# EAGLE schematic LPS3P3 (EAGLE 7.7.0)
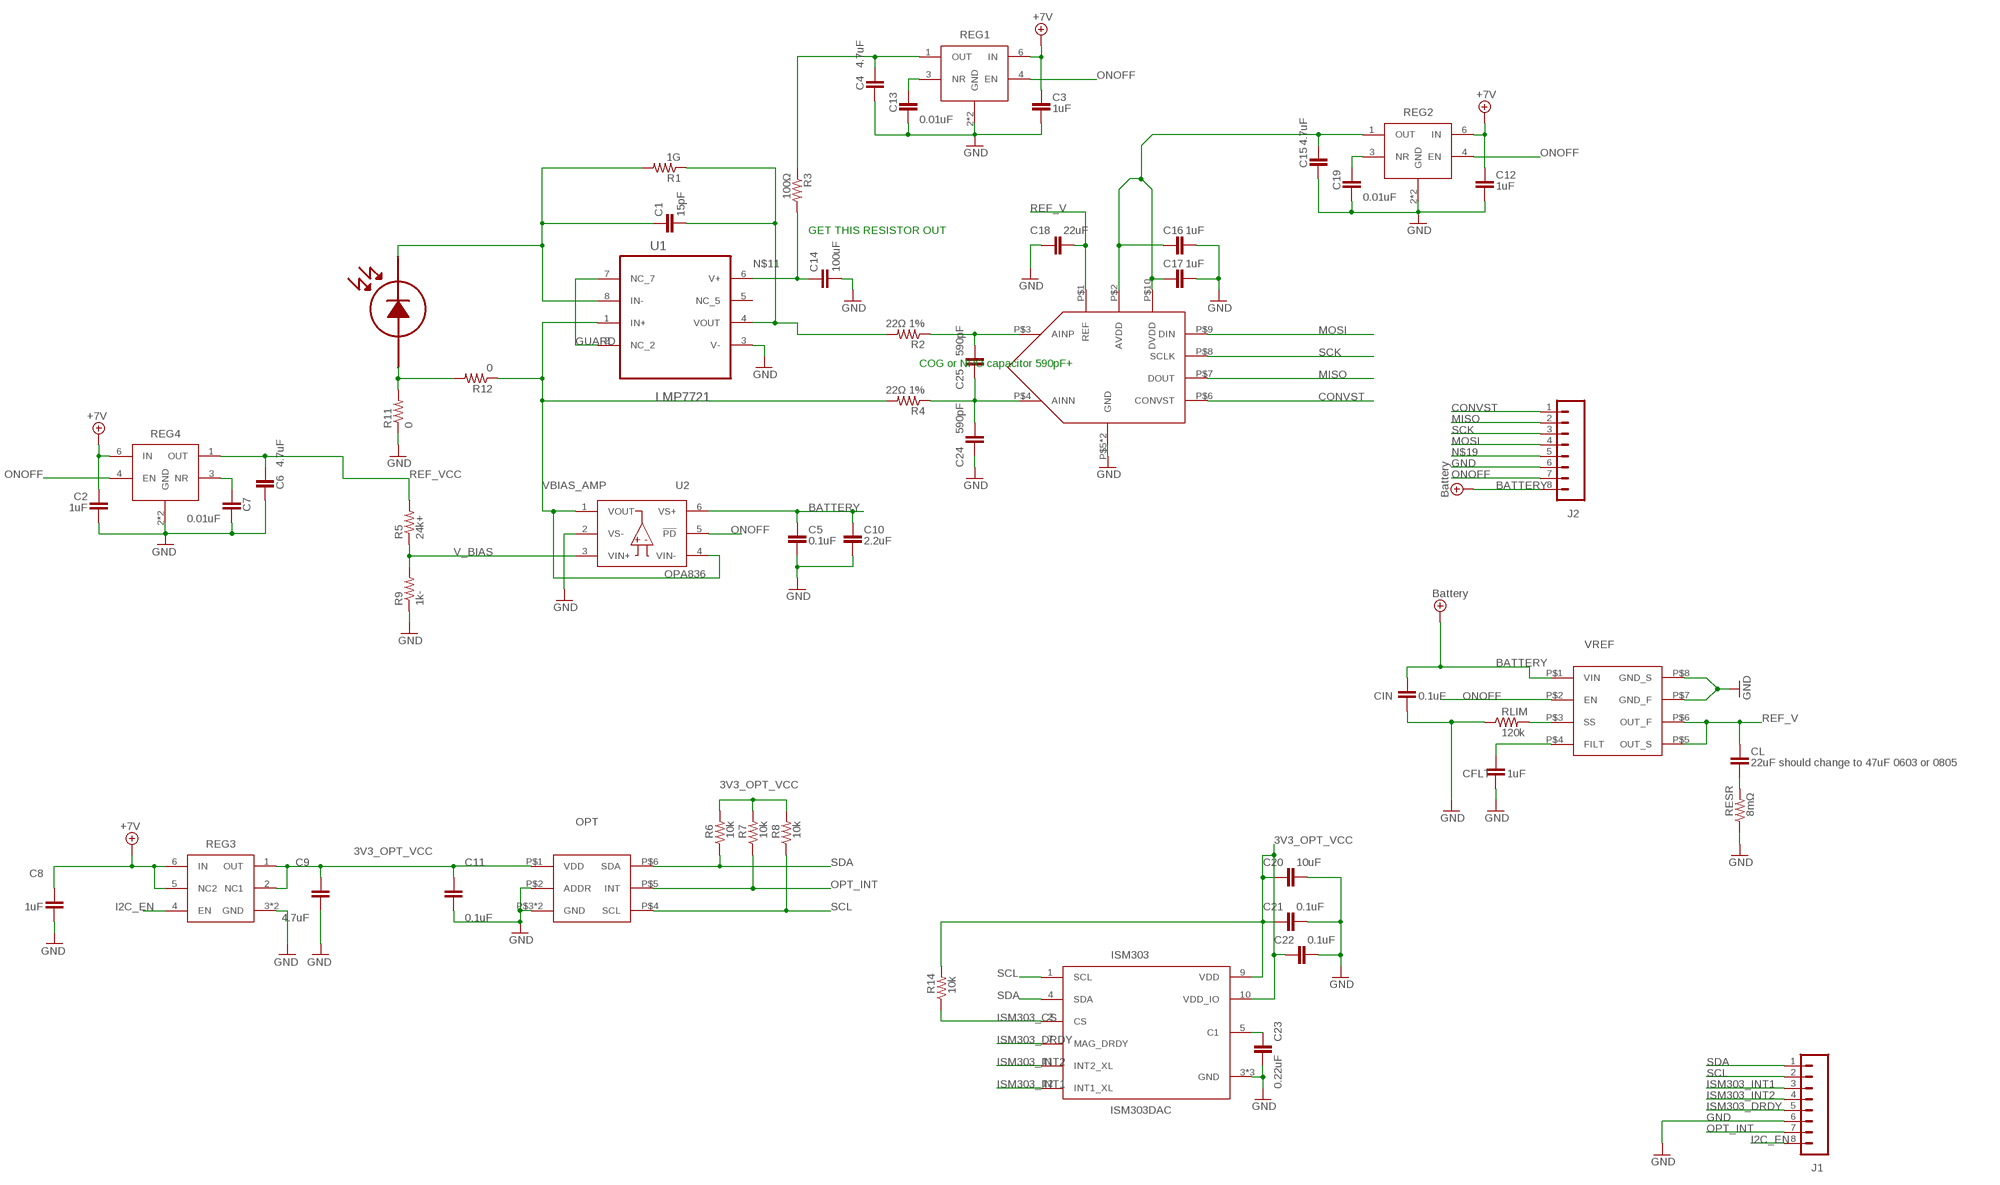
[diagram p0: schematic, sheet 1]

## Parts
ADC  ADS8866VSON10  [VSON-10]
C1  15pF  CAP_1206CAP-1206  [1206]
C2  1uF  CAP_0402  [SMD_0402]
C3  1uF  CAP_0402  [SMD_0402]
C4  4.7uF  CAP_0402  [SMD_0402]
C5  0.1uF  CAP_0402  [SMD_0402]
C6  4.7uF  CAP_0402  [SMD_0402]
C7  0.01uF  CAP_0402  [SMD_0402]
C8  1uF  CAP_0402  [SMD_0402]
C9  4.7uF  CAP_0402  [SMD_0402]
C10  2.2uF  CAP_0402  [SMD_0402]
C11  0.1uF  CAP_0402  [SMD_0402]
C12  1uF  CAP_0402  [SMD_0402]
C13  0.01uF  CAP_0402  [SMD_0402]
C14  100uF  2.2UF-25V-+80/-20(0805)  [0805-CAP]
C15  4.7uF  CAP_0402  [SMD_0402]
C16  1uF  CAP_0402  [SMD_0402]
C17  1uF  CAP_0402  [SMD_0402]
C18  22uF  CAP_0402  [SMD_0402]
C19  0.01uF  CAP_0402  [SMD_0402]
C20  10uF  CAP_0402  [SMD_0402]
C21  0.1uF  CAP_0402  [SMD_0402]
C22  0.1uF  CAP_0402  [SMD_0402]
C23  0.22uF  CAP_0402  [SMD_0402]
C24  590pF  CAP_0402  [SMD_0402]
C25  590pF  CAP_0402  [SMD_0402]
CFLT  1uF  CAP_0402  [SMD_0402]
CIN  0.1uF  CAP_0402  [SMD_0402]
CL  22uF should change to 47uF 0603 or 0805  CAP_0402  [SMD_0402]
D1  S1133_3  [S1133_FLAT_SIDEWAYS]
ISM303  ISM303DAC  [LGA_12_ST]
J1  8_PIN_0.05_INCH_SMD_FEMALE  [8_PIN_0.05"_SMD_ALTERN]
J2  8_PIN_0.05_INCH_SMD_FEMALE  [8_PIN_0.05"_SMD_ALTERN]
OPT  OPT3001  [USON-6-0.65-OPT3001]
R1  1G  RESISTOR1206  [1206]
R2  22Ω 1%  RESISTOR0402  [SMD_0402]
R3  100Ω  RESISTOR0402  [SMD_0402]
R4  22Ω 1%  RESISTOR0402  [SMD_0402]
R5  24k+  RESISTOR0402  [SMD_0402]
R6  10k  RESISTOR0402  [SMD_0402]
R7  10k  RESISTOR0402  [SMD_0402]
R8  10k  RESISTOR0402  [SMD_0402]
R9  1k-  RESISTOR0402  [SMD_0402]
R11  0  RESISTOR0402  [SMD_0402]
R12  0  RESISTOR0402  [SMD_0402]
R14  10k  RESISTOR0402  [SMD_0402]
REG1  TPS717-Q1  [WSON-6-1.5MM-NO-PAD]
REG2  TPS717-Q1  [WSON-6-1.5MM-NO-PAD]
REG3  TPS706USON-6  [USON-6-0.65]
REG4  TPS717-Q1  [WSON-6-1.5MM-NO-PAD]
RESR  8mΩ  RESISTOR0402  [SMD_0402]
RLIM  120k  RESISTOR0402  [SMD_0402]
U1  LMP7721  [SOIC127P600X175-8N]
U2  OPA836  [OPA836_SOT23]
VREF  REF6225  [VSSOP8]

## Nets
3V3_OPT_VCC: C9.1 C11.1 C20.1 C21.1 C22.1 ISM303.9(VDD) ISM303.10(VDD_IO) OPT.P$1(VDD) R6.1 R7.1 R8.1 R14.1 REG3.1(OUT) REG3.2(NC1)
BATTERY: C2.1 C3.1 C5.1 C8.1 C10.1 C12.1 CIN.1 J2.8 REG1.6(IN) REG2.6(IN) REG3.5(NC2) REG3.6(IN) REG4.6(IN) U2.6(VS+) VREF.P$1(VIN) ; supply symbol labelled Battery, +7V
CONVST: ADC.P$6(CONVST) J2.1
FLT: CFLT.1 VREF.P$4(FILT)
GND: ADC.P$5(GND) ADC.P$PAD(GND) C2.2 C3.2 C4.2 C5.2 C6.2 C7.2 C8.2 C9.2 C10.2 C11.2 C12.2 C13.2 C14.2 C15.2 C16.2 C17.2 C18.1 C19.2 C20.2 C21.2 C22.2 C23.2 C24.1 CFLT.2 CIN.2 ISM303.3(GND) ISM303.6(GND) ISM303.8(GND) J1.6 J2.6 OPT.P$2(ADDR) OPT.P$3(GND) OPT.PAD(GND) R9.2 R11.2 REG1.2(GND) REG1.5(GND) REG2.2(GND) REG2.5(GND) REG3.3(GND) REG3.PAD(GND) REG4.2(GND) REG4.5(GND) RESR.2 RLIM.2 U1.3(V-) U2.2(VS-) VREF.P$7(GND_F) VREF.P$8(GND_S)
GUARD: U1.2(NC_2) U1.7(NC_7)
I2C_EN: J1.8 REG3.4(EN)
ISM303_CS: ISM303.2(CS) R14.2
ISM303_DRDY: ISM303.7(MAG_DRDY) J1.5
ISM303_INT1: ISM303.12(INT1_XL) J1.3
ISM303_INT2: ISM303.11(INT2_XL) J1.4
MISO: ADC.P$7(DOUT) J2.2
MOSI: ADC.P$9(DIN) J2.4
N$1: ADC.P$3(AINP) C25.2 R2.2
N$7: CL.2 RESR.1
N$8: C1.P$1 D1.CATHODE R1.P$1 U1.8(IN-)
N$9: C19.1 REG2.3(NR)
N$10: D1.ANODE R11.1 R12.1
N$11: C14.1 R3.1 U1.6(V+)
N$13: ADC.P$4(AINN) C24.2 C25.1 R4.2
N$14: C23.1 ISM303.5(C1)
N$15: C7.1 REG4.3(NR)
N$16: C13.1 REG1.3(NR)
N$19: J2.5
ONOFF: J2.7 REG1.4(EN) REG2.4(EN) REG4.4(EN) U2.5(!PD!) VREF.P$2(EN)
OPAMP_VCC: C4.1 R3.2 REG1.1(OUT)
OPT_INT: J1.7 OPT.P$5(INT) R7.2
REF_V: ADC.P$1(REF) C18.2 CL.1 VREF.P$5(OUT_S) VREF.P$6(OUT_F)
REF_VCC: C6.1 R5.1 REG4.1(OUT)
SCK: ADC.P$8(SCLK) J2.3
SCL: ISM303.1(SCL) J1.2 OPT.P$4(SCL) R8.2
SDA: ISM303.4(SDA) J1.1 OPT.P$6(SDA) R6.2
SS: RLIM.1 VREF.P$3(SS)
TIA_OUT: C1.P$2 R1.P$2 R2.1 U1.4(VOUT)
V_BIAS: R5.2 R9.1 U2.3(VIN+)
VBIAS_AMP: R4.1 R12.2 U1.1(IN+) U2.1(VOUT) U2.4(VIN-)
VCC_ADC: ADC.P$2(AVDD) ADC.P$10(DVDD) C15.1 C16.1 C17.1 REG2.1(OUT)
Unconnected: U1.5(NC_5)

## Notes on the sheet
- GET THIS RESISTOR OUT
- COG or NPO capacitor 590pF+

## Library data of the parts
ADC = ADCs:ADS8866: ADS8866 16-bit precision analog to digital converter up to 100kSPS
C1 = Passives:CAP_1206
C2-C13 C15-C25 CFLT CIN CL = Passives:CAP_0402: 0402 capacitor
C14 = SparkFun-Capacitors:2.2UF-25V-+80/-20(0805): CAP-11624; PROD_ID: CAP-11624; VALUE: 2.2uF
D1 = S1133:S1133_3: S1133 low dark current photodiode by Hamamatsu
ISM303 = MAG_ACC_GYR:ISM303DAC: ISM303 Accelerometer Magnetometer 2x2mm LGA-12
J1 J2 = Connectors:8_PIN_0.05_INCH_SMD_FEMALE
OPT = Nikos-library:OPT3001
R1-R9 R11 R12 R14 RESR RLIM = Passives:RESISTOR
REG1 REG2 REG4 = LPS3P2:TPS717-Q1
REG3 = Nikos-library:TPS706: TPS706 in a USON-6 0.65mm pitch 2x2mm package
U1 = Nikos-library:LMP7721
U2 = Op-Amps:OPA836
VREF = Voltage-regulators:REF6225: Voltage Reference TI REF6225

## Net classes
0 default: width 0.152 mm, clearance 0.203 mm
1 supply: width 0.254 mm, clearance 0.254 mm